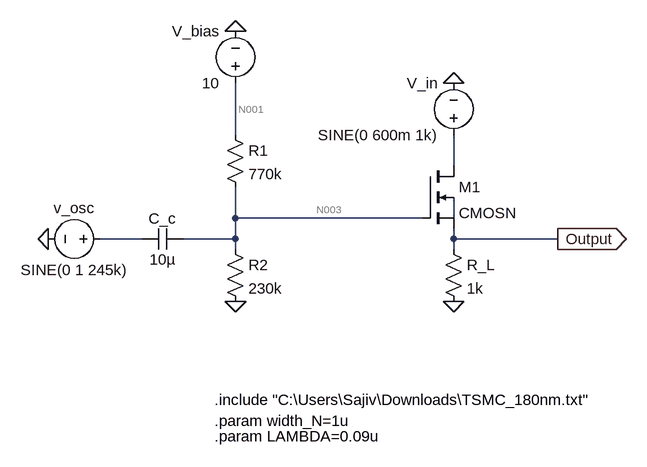
[diagram p0: schematic mixer.asc]
mixer.asc, the LTspice schematic file:
Version 4
SHEET 1 880 936
WIRE 16 64 16 -16
WIRE 352 112 352 64
WIRE 16 192 16 144
WIRE 304 192 16 192
WIRE 352 192 352 160
WIRE -128 224 -192 224
WIRE 16 224 16 192
WIRE 16 224 -64 224
WIRE 352 224 352 208
WIRE 512 224 352 224
WIRE 16 240 16 224
WIRE 352 240 352 224
FLAG 16 320 0
FLAG -272 224 0
FLAG 16 -96 0
FLAG 352 -16 0
FLAG 352 320 0
FLAG 512 224 Output
IOPIN 512 224 Out
SYMBOL nmos4 304 112 R0
SYMATTR InstName M1
SYMATTR Value CMOSN
SYMATTR Value2 l={2*LAMBDA} w={width_N} ad={5*width_ N*LAMBDA} as={5*width_ N*LAMBDA} pd={10*LAMBDA+2*width_N} ps={10*LAMBDA+2*width_N}
SYMBOL res 0 48 R0
SYMATTR InstName R1
SYMATTR Value 770k
SYMBOL res 0 224 R0
SYMATTR InstName R2
SYMATTR Value 230k
SYMBOL cap -64 208 R90
WINDOW 0 0 32 VBottom 2
WINDOW 3 32 32 VTop 2
SYMATTR InstName C_c
SYMATTR Value 10µ
SYMBOL voltage -176 224 R90
WINDOW 0 -32 56 VBottom 2
WINDOW 3 32 56 VTop 2
WINDOW 123 0 0 Left 0
WINDOW 39 0 0 Left 0
SYMATTR InstName v_osc
SYMATTR Value SINE(0 1 245k)
SYMBOL voltage 16 0 R180
WINDOW 0 24 96 Left 2
WINDOW 3 24 16 Left 2
SYMATTR InstName V_bias
SYMATTR Value 10
SYMBOL voltage 352 80 R180
WINDOW 0 24 96 Left 2
WINDOW 3 24 16 Left 2
WINDOW 123 0 0 Left 0
WINDOW 39 0 0 Left 0
SYMATTR InstName V_in
SYMATTR Value SINE(0 600m 1k)
SYMBOL res 336 224 R0
SYMATTR InstName R_L
SYMATTR Value 1k
TEXT -16 472 Left 2 !.include "C:\\Users\\Sajiv\\Downloads\\TSMC_180nm.txt"
TEXT -16 504 Left 2 !.param width_N=1u
TEXT -16 528 Left 2 !.param LAMBDA=0.09u

The netlist it stands for:
* mixer.asc
M1 N002 N003 Output N004 CMOSN l={2*LAMBDA} w={width_N} ad={5*width_ N*LAMBDA} as={5*width_ N*LAMBDA} pd={10*LAMBDA+2*width_N} ps={10*LAMBDA+2*width_N}
R1 N001 N003 770k
R2 N003 0 230k
C_c N003 N005 10µ
v_osc N005 0 SINE(0 1 245k)
V_bias N001 0 10
V_in N002 0 SINE(0 600m 1k)
R_L Output 0 1k
.model NMOS NMOS
.model PMOS PMOS
.lib standard.mos
.include "C:\Users\Sajiv\Downloads\TSMC_180nm.txt"
.param width_N=1u
.param LAMBDA=0.09u
.backanno
.end

* Results of the author's LTspice run, read from the files saved beside the schematic
* Operating Point, zero values left out:
*   V(n003) = 2.3 V
*   V(n001) = 10 V
*   I(R1) = 10 µA
*   I(R2) = 10 µA
*   I(V_bias) = -10 µA